# Altium schematic sheet PWR_MGMT.SchDoc
size B; SheetNumber: 7; SheetTotal: 7
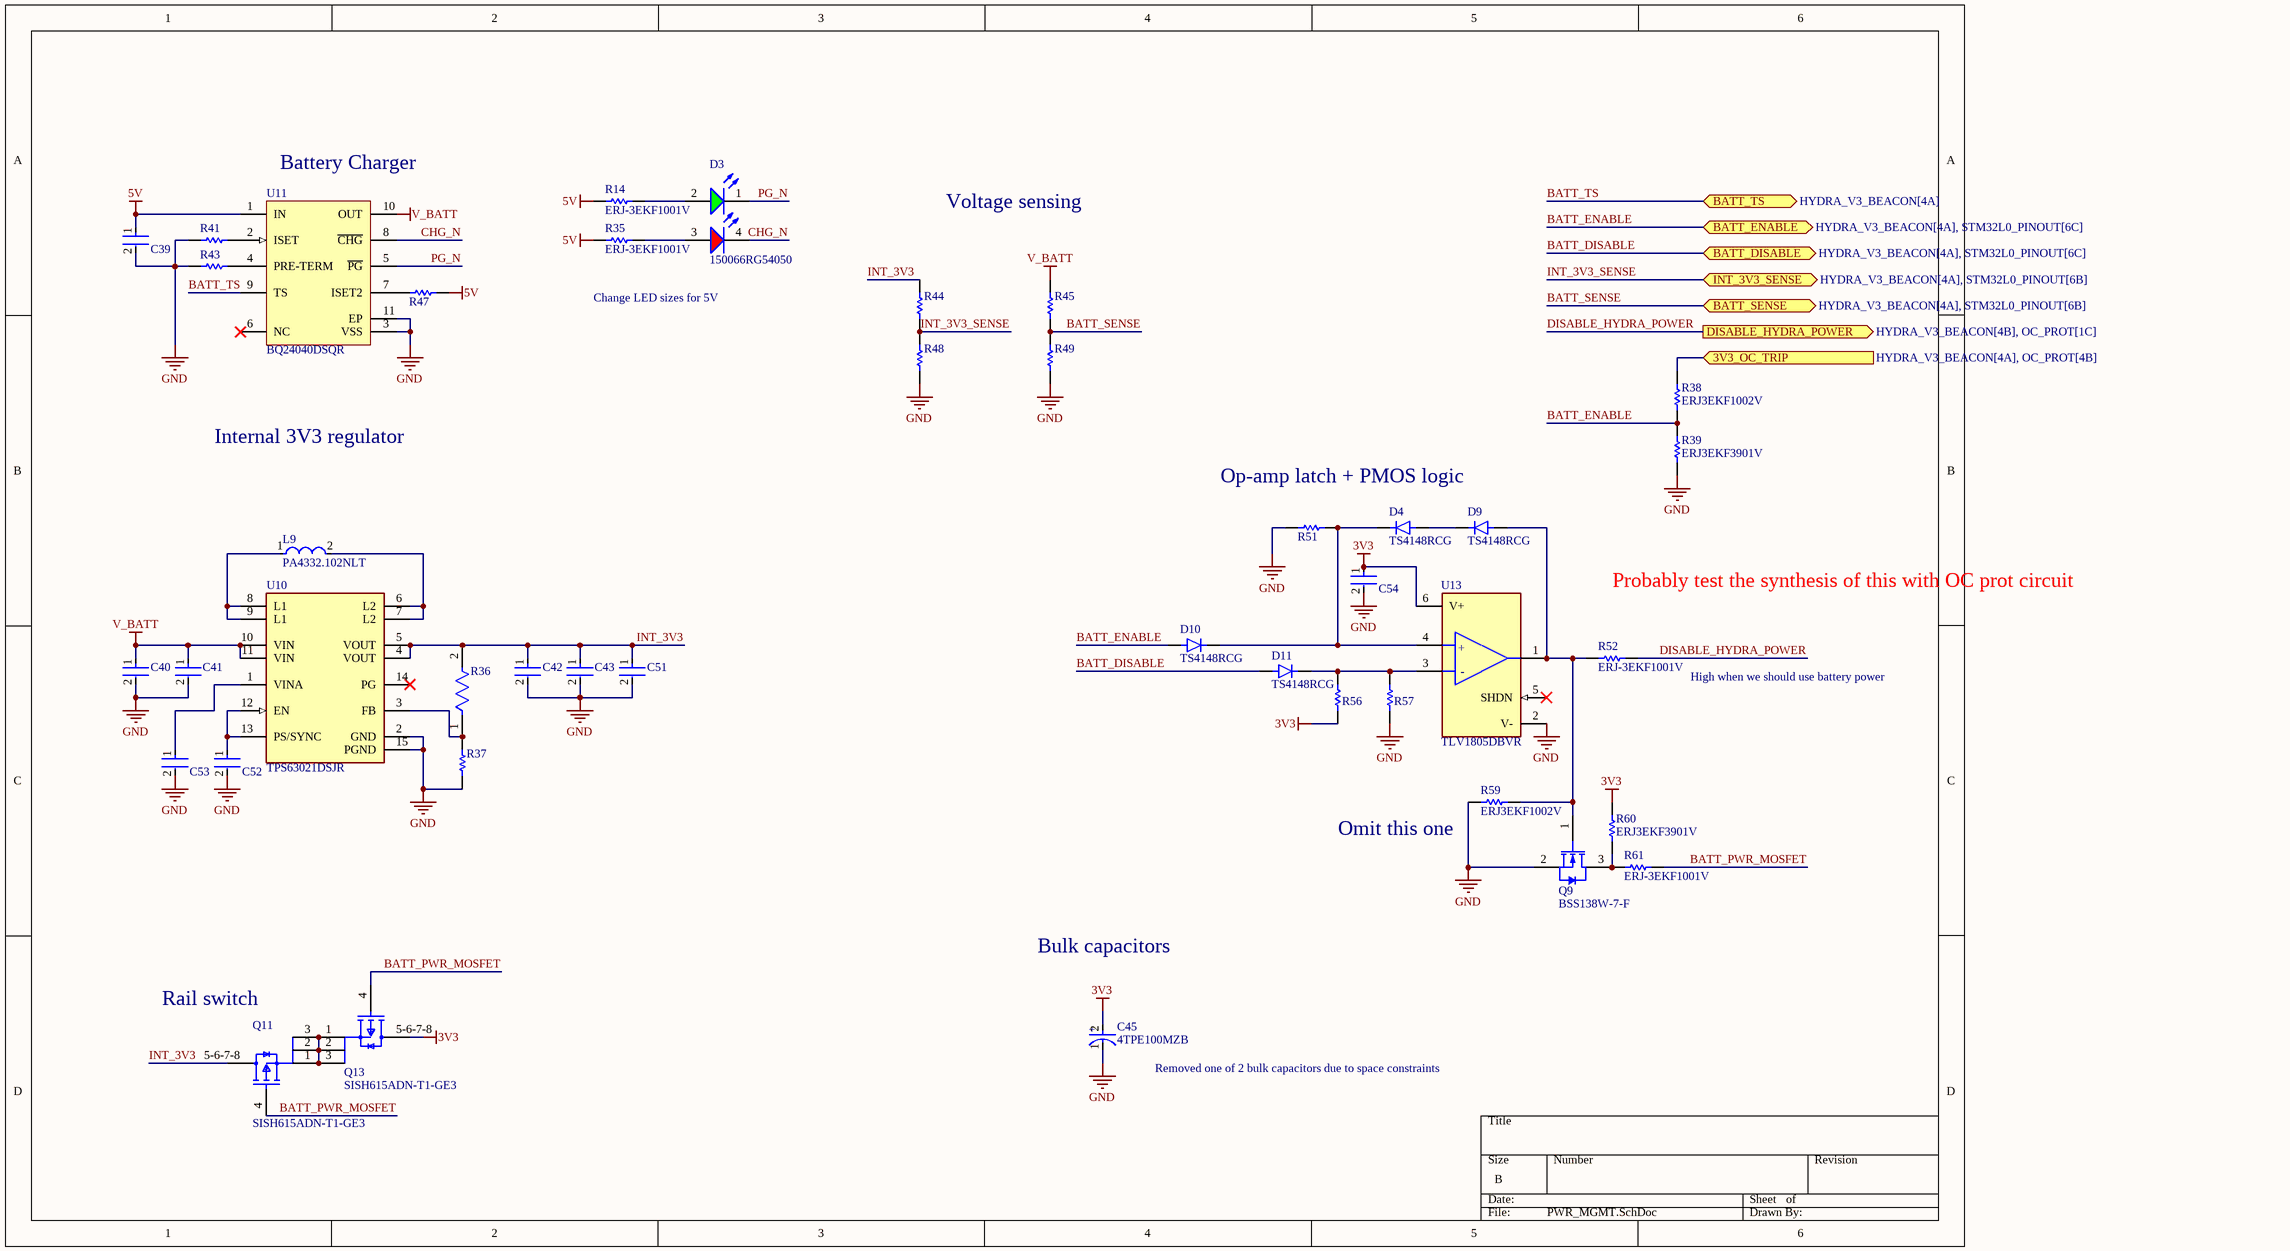
[diagram p0: PWR_MGMT.SchDoc]

## Parts
C39  C0402C104K8PACTU  [FP-C0402-BB-MFG]  (value not drawn)
C40  C0805C106K8PACTU  [FP-C0805C-DG-MFG]  (value not drawn)
C41  C0805C106K8PACTU  [FP-C0805C-DG-MFG]  (value not drawn)
C42  GRM21BR60J226ME39L  [FP-GRM21B-0_15-MFG]  (value not drawn)
C43  GRM21BR60J226ME39L  [FP-GRM21B-0_15-MFG]  (value not drawn)
C45  4TPE100MZB  [FP-POSCAP-B2-MFG]
C51  GRM21BR60J226ME39L  [FP-GRM21B-0_15-MFG]  (value not drawn)
C52  C0402C104K8PACTU  [FP-C0402-BB-MFG]  (value not drawn)
C53  C0402C104K8PACTU  [FP-C0402-BB-MFG]  (value not drawn)
C54  C0402C104K8PACTU  [FP-C0402-BB-MFG]  (value not drawn)
D3  150066RG54050  [WL-SBCD_0606]
D4  TS4148RCG  [TS4148RCG-Footprint-1]
D9  TS4148RCG  [TS4148RCG-Footprint-1]
D10  TS4148RCG  [TS4148RCG-Footprint-1]
D11  TS4148RCG  [TS4148RCG-Footprint-1]
L9  PA4332.102NLT  [FP-PA4332-MFG]
Q9  BSS138W-7-F  [DIOD-SOT323-3_V]
Q11  SISH615ADN-T1-GE3  [SISH615ADN-T1-GE3-Footprint-1]
Q13  SISH615ADN-T1-GE3  [SISH615ADN-T1-GE3-Footprint-1]
R14  ERJ-3EKF1001V  [RESC1608X55X30LL15T15]
R35  ERJ-3EKF1001V  [RESC1608X55X30LL15T15]
R36  ERJ-3EKF1004V  [FP-ERJ3EK-IPC_C]  (value not drawn)
R37  ERJ3EKF1803V  [RESC1608X55X30LL15T15]  (value not drawn)
R38  ERJ3EKF1002V  [RESC1609X55X30LL15T15]
R39  ERJ3EKF3901V  [RESC1608X55X30ML15T15]
R41  ERJ-3EKF1001V  [RESC1608X55X30LL15T15]  (value not drawn)
R43  ERJ-3EKF1001V  [RESC1608X55X30LL15T15]  (value not drawn)
R44  ERJ3EKF1002V  [RESC1609X55X30LL15T15]  (value not drawn)
R45  ERJ3EKF1002V  [RESC1609X55X30LL15T15]  (value not drawn)
R47  ERJ3EKF1002V  [RESC1609X55X30LL15T15]  (value not drawn)
R48  ERJ3EKF1002V  [RESC1609X55X30LL15T15]  (value not drawn)
R49  ERJ3EKF1002V  [RESC1609X55X30LL15T15]  (value not drawn)
R51  ERJ3EKF1002V  [RESC1609X55X30LL15T15]  (value not drawn)
R52  ERJ-3EKF1001V  [RESC1608X55X30LL15T15]
R56  ERJ3EKF1002V  [RESC1609X55X30LL15T15]  (value not drawn)
R57  ERJ3EKF1002V  [RESC1609X55X30LL15T15]  (value not drawn)
R59  ERJ3EKF1002V  [RESC1609X55X30LL15T15]
R60  ERJ3EKF3901V  [RESC1608X55X30ML15T15]
R61  ERJ-3EKF1001V  [RESC1608X55X30LL15T15]
U10  TPS63021DSJR  [FP-DSJ0014A-MFG]
U11  BQ24040DSQR  [DSQ0010A_V]
U13  TLV1805DBVR  [FP-DBV0006A-IPC_C]

## Ports
3V3_OC_TRIP (in, see HYDRA_V3_BEACON[4A], OC_PROT[4B]), BATT_DISABLE (bidir, see HYDRA_V3_BEACON[4A], STM32L0_PINOUT[6C]), BATT_ENABLE (bidir, see HYDRA_V3_BEACON[4A], STM32L0_PINOUT[6C]), BATT_SENSE (bidir, see HYDRA_V3_BEACON[4A], STM32L0_PINOUT[6B]), BATT_TS (bidir, see HYDRA_V3_BEACON[4A]), DISABLE_HYDRA_POWER (out, see HYDRA_V3_BEACON[4B], OC_PROT[1C]), INT_3V3_SENSE (bidir, see HYDRA_V3_BEACON[4A], STM32L0_PINOUT[6B])

## Nets
3V3: C45.2(A) C54.1 Q13.5-6-7-8(D) R56.1 R60.2 U13.6(V+)
5V: C39.1 R14.1 R35.1 R47.2 U11.1(IN)
GND: C39.2 C40.2 C41.2 C42.2 C43.2 C45.1(C) C51.2 C52.2 C53.2 C54.2 Q9.2(S) R37.1 R39.1 R41.2 R43.2 R48.1 R49.1 R51.2 R57.1 R59.2 U10.2(GND) U10.15(PGND) U11.3(VSS) U11.11(EP) U13.2(V-)
V_BATT: C40.1 C41.1 R45.2 U10.10(VIN) U10.11(VIN) U11.10(OUT)
3V3_OC_TRIP: R38.2 ; port 3V3_OC_TRIP
BATT_DISABLE: D11.A ; port BATT_DISABLE
BATT_ENABLE: D10.A R38.1 R39.2 ; port BATT_ENABLE
BATT_PWR_MOSFET: Q11.4(G) Q13.4(G) R61.2
BATT_SENSE: R45.1 R49.2 ; port BATT_SENSE
BATT_TS: U11.9(TS) ; port BATT_TS
CHG_N: D3.4(K) U11.8(~{CHG})
DISABLE_HYDRA_POWER: R52.1 ; port DISABLE_HYDRA_POWER
INT_3V3: C42.1 C43.1 C51.1 Q11.5-6-7-8(D) R36.2 R44.2 U10.4(VOUT) U10.5(VOUT)
INT_3V3_SENSE: R44.1 R48.2 ; port INT_3V3_SENSE
PG_N: D3.1(K) U11.5(~{PG})
NetC52_1: C52.1 U10.12(EN) U10.13(PS/SYNC)
NetC53_1: C53.1 U10.1(VINA)
NetD3_2: D3.2(A) R14.2
NetD3_3: D3.3(A) R35.2
NetD4_A: D4.A D9.C(K)
NetD4_C: D4.C(K) D10.C(K) R51.1 U13.4(+IN)
NetD9_A: D9.A Q9.1(G) R52.2 R59.1 U13.1(OUT)
NetD11_C: D11.C(K) R56.2 R57.2 U13.3(-IN)
NetL9_1: L9.1 U10.8(L1) U10.9(L1)
NetL9_2: L9.2 U10.6(L2) U10.7(L2)
NetQ9_3: Q9.3(D) R60.1 R61.1
NetQ11_1: Q11.1(S) Q11.2(S) Q11.3(S) Q13.1(S) Q13.2(S) Q13.3(S)
NetR36_1: R36.1 R37.2 U10.3(FB)
NetR41_1: R41.1 U11.2(ISET)
NetR43_1: R43.1 U11.4(PRE-TERM)
NetR47_1: R47.1 U11.7(ISET2)

Not connected (* = marked no-connect by the designer): U10 14(PG)*; U11 6(NC)*; U13 5(SHDN)*

## Notes on the sheet
- (near U11) Battery Charger
- Voltage sensing
- Change LED sizes for 5V
- Internal 3V3 regulator
- Op-amp latch + PMOS logic
- Probably test the synthesis of this with OC prot circuit
- High when we should use battery power
- (near R59) Omit this one
- (near Q11) Rail switch
- Bulk capacitors
- Removed one of 2 bulk capacitors due to space constraints
- (in symbol CMP-04896-000098-1) +; -
- (in symbol CMP-05428-001141-1) +

## Library data of the parts
C39 C52-C54 = CMP-2008-02046-2: CAP CER 0.1UF 10V X5R 0402; Manufacturer: Kemet; Material: Ceramic; Capacitance: 0.10 μF; Temperature Coefficient: 15%; Tolerance: 0.1; Value: 0.10 μF; Package: C0402-BB; Temperature: -55°C to +125°C; ComponentLink2Description: Datasheet; Temperature Characteristic: X5R; Device Class L1: Passive Components; Height: 0.55mm; Lead Free: Yes; ComponentLink2URL: https://content.kemet.com/datasheets/KEM_C1002_X7R_SMD.pdf; Device Class L2: Capacitors; Temperature Range Low: -55°C; Temperature Range High: +125°C; RoHS: TRUE; Octopart: https://octopart.com/c0402c104k8pactu-kemet-140039; Automotive: No; Mouser Description: Capacitor 100 nF 10 VDC 0402; Category: Cap; Voltage Rating: 10 V; Digikey Description: CAP CER 0.1UF 10V X5R 0402; Ipc Land Pattern Name: CAPC10050X50; Device Class L3: Ceramic Capacitors; Manufacturer Part Number: C0402C104K8PACTU
C40 C41 = CMP-2007-03243-2: CAP CER 10UF 10V X5R 0805; Manufacturer: Kemet; 3DS Part Number: 220-00001; Tolerance: 10%; Temperature Coefficient: 15%; Material: Ceramic; Device Class L2: Capacitors; Device Class L1: Passive Components; ComponentLink2URL: https://content.kemet.com/datasheets/KEM_C1006_X5R_SMD.pdf; Height: 1.4mm; Lead Free: Yes; Manufacturer Part Number: C0805C106K8PACTU; Digikey Description: CAP CER 10UF 10V X5R 0805; Octopart: https://octopart.com/c0805c106k8pactu-kemet-98697; Capacitance: 10uF; Value: 10uF; Temperature Range Low: -55°C; Temperature: -55°C to +85°C; Automotive: No; Mouser Description: CAP CER 10UF 10V X5R 0805; Ipc Land Pattern Name: CAPC200125X125; Temperature Range High: +85°C; Voltage: 10V; RoHS: TRUE; Device Class L3: Ceramic Capacitors; ComponentLink2Description: Datasheet; Voltage Rating: 10V; Package: C0805C-DG; Temperature Characteristic: X5R; Category: Cap
C42 C43 C51 = CMP-2007-03385-2: Chip Multilayer Ceramic Capacitors for General Purpose, 0805, 22uF, X5R, 15%, 20%, 6.3V; Material: Ceramic; Max Operating Temperature: 85°C; Voltage: 6.3V; Min Operating Temperature: -55°C; Case/Package: 0805; Thickness: 0.053inch; Dielectric: X5R; Packaging: Tape and Reel; Depth: 1.25mm; Termination: SMD/SMT; Voltage Rating (DC): 6.3V; Radiation Hardening: No; Tolerance: 20%; Mount: Surface Mount; Lead Free: Lead Free; Package Quantity: 1; REACH SVHC: No SVHC; Voltage Rating: 6.3V; Capacitance: 22uF; Length: 2mm; Case Code (Imperial): 0805; Case Code (Metric): 2012; Width: 0.049inch; Height: 1.25mm
C45 = CMP-05428-001141-1: Molded Tantalum Polymer Capacitor 100uF 20% 4V life 1000Hours SMD 1411; Leakage Current: 40uA; Polarity: Polar; Dissipation Factor: 8%; ESR (Equivalent Series Resistance): 35mR; Ripple Current: 1.4A; Capacitance: 100uF; Voltage: 4V; Voltage Rating (DC): 4V; Package Quantity: 2000; Packaging: Tape and Reel; RoHS Compliant: Yes; Voltage Rating: 4V; Case Code (Imperial): 1210; Construction: Flat; Max Operating Temperature: 105°C; Termination: SMD/SMT; Case Code (Metric): 3528; Case/Package: Molded; Tolerance: 20%; Min Operating Temperature: -55°C; Lead Free: Lead Free; Features: General Purpose; Height: 1.9mm; Length: 3.5mm; Series: POSCAP™ TPE; Number of Pins: 2; Height - Seated (Max): 0.079inch; Mount: Surface Mount; Width: 2.8mm; REACH SVHC: No SVHC; Radiation Hardening: No; Depth: 2.8mm
D3 = CMP-004-00034-2: Led, Red/Grn, 180Mcd/230Mcd, 624Nm/525Nm Rohs Compliant: Yes
D4 D9-D11 = CMP-004-00036-1: SMD Si-Diode 75V 100mA 0603
L9 = CMP-16293-000006-1: FIXED IND 1UH 5.8A 26 MOHM SMD; DC Resistance (DCR): 26mR; Self Resonant Frequency: 37MHz; Tolerance: 20%; Saturation Current: 8.5A; Core Material: Ferrite; Shielding: Shielded; Test Frequency: 1MHz; Min Operating Temperature: -40°C; Composition: Wirewound; Max Operating Temperature: 125°C; Packaging: Tape and Reel; Mount: Surface Mount; Length: 0.165inch; Current Rating: 5.8A; Inductance: 1uH; Case/Package: Nonstandard; Height - Seated (Max): 0.079inch; Width: 0.165inch
Q9 = CMP-2000-05968-1: N-Channel Enhancement Mode Mosfet, 50 V, 200 mA, -55 to 150 degC, 6-Pin SOT-323, RoHS, Tape and Reel; Typical Turn-Off Delay Time: 20ns; Number of Channels: 1Channel; Type: EnhancementModeFieldEffectTransistor; Brand: DiodesIncorporated; Vds - Drain-Source Breakdown Voltage: 75V; Vgs - Gate-Source Voltage: 20V; Rds On - Drain-Source Resistance: 1.4Ohms; Transistor Type: 1N-Channel; Configuration: Single; Unit Weight: 0.000212oz; Pd - Power Dissipation: 200mW; Id - Continuous Drain Current: 200mA; Forward Transconductance - Min: 0.1S; Manufacturer URL: http://www.diodes.com/; Series: BSS138; Package Description: 3-Pin Small Outline Transistor, Body 2 x 1.25 mm, Pitch 0.65 mm; Mounting Technology: SurfaceMount; Product Category: MOSFET; RoHS: True; Maximum Operating Temperature: +150C; Height: 1mm; Length: 2.2mm; Technology: Si; Width: 1.35mm; Datasheet URL: http://www.diodes.com/_files/datasheets/ds30206.pdf; Manufacturer: DiodesIncorporated; Package / Case: SOT-323-3; Typical Turn-On Delay Time: 20ns; Transistor Polarity: N-Channel; Factory Pack Quantity: 3000; Packaging: Reel; Product: MOSFETSmallSignal; Datasheet Version: Rev. 11-2, 09/2013; Package Reference: SOT323; Minimum Operating Temperature: -55C; Mounting Style: SMD/SMT; Channel Mode: Enhancement
Q11 Q13 = CMP-013-00036-1: Trans MOSFET P-CH 20V 22.1A 8-Pin PowerPAK 1212 EP T/R
R14 R35 R41 R43 R52 R61 = CMP-2000-00180-1: Manufacturer: Panasonic; Part Number: ERJ-3EKF1001V
R36 = CMP-1012-00849-3: RES SMD 1M OHM 1% 1/10W 0603; Resistance: 1MR; Voltage Rating: 75V; Temperature Coefficient: 100ppm/°C; Power Rating: 100mW; REACH SVHC: No SVHC; Radiation Hardening: No; Features: Automotive AEC-Q200; Case Code (Metric): 1608; Resistance Tolerance: 1%; Case/Package: 0603; Termination: SMD/SMT; Max Operating Temperature: 155°C; Tolerance: 1%; Size Code: 0603; Case Code (Imperial): 0603; Min Operating Temperature: -55°C; Number of Pins: 2; Mount: Surface Mount; Package Quantity: 1; Military Standard: Not; Voltage Rating (DC): 75V; Depth: 0.8mm; Packaging: Tape and Reel; Width: 0.8mm; Number of Terminations: 2; Length: 1.6mm; Height: 0.022inch; RoHS Compliant: Yes; Resistor Type: Thick Film; Contact Plating: Tin; Lead Free: Lead Free; Series: ERJ; Construction: Rectangular; Max Power Dissipation: 100mW
R37 = CMP-2000-00296-1: Manufacturer: Panasonic; Part Number: ERJ3EKF1803V
R38 R44 R45 R47-R49 R51 R56 R57 R59 = CMP-1012-00623-3: Chip Resistor, 10 KOhm, +/- 1%, 0.1 W, -55 to 155 degC, 0603 (1608 Metric), RoHS, Tape and Reel; Manufacturer: Panasonic; Voltage Rating: 75V; Case\/Package: 0603; Power Rating: 100mW; Resistance: 10KOhm; Temperature Coefficient: 100ppm\/degreesC; Number of Pins: 2; Package Reference: 603; Depth: 0.8mm; Mount: SurfaceMount; Package Description: 2-Pin Surface Mount Device, Body 1.6 x 0.85 mm; Datasheet Version: 02/2017; Length: 1.6mm; Lead Free: LeadFree; Height: 0.45mm; Number of Terminations: 2; Max Power Dissipation: 100mW; Min Operating Temperature: -55degC; Datasheet URL: https://industrial.panasonic.com/cdbs/www-data/pdf/RDA0000/AOA0000C304.pdf; Termination: SMD/SMT; Case Code (Metric): 1608; Case Code (Imperial): 0603; Tolerance: 1%; Max Operating Temperature: 155degC; RoHSCompliant: true; Voltage Rating (DC): 75V; Radiation Hardening: No; Packaging: TapeandReel; Composition: ThickFilm; Mounting Technology: SurfaceMount; Manufacturer URL: http://www.panasonic.com/; Width: 0.031inch; REACH SVHC: NoSVHC; Contact Plating: Tin; Military Standard: Not; Package Quantity: 1
R39 R60 = CMP-2000-00475-1: Manufacturer: Panasonic; Part Number: ERJ3EKF3901V
U10 = CMP-04918-000102-1: IC REG BCK BST 3.3V 3.5A 14VSON; Manufacturer: Texas Instruments; Max Junction Temp: +125°C; Output Current: 2A; Switching Topology: Buck-Boost; Min Supply Voltage: 1.8V; Standoff Height: 0mm; Switching Frequency: 2400kHz; Output Type: AdjustableProgrammable; Max Supply Voltage: 5.5V; Output Voltage: 1.2-5.5V; Max Duty Cycle: 100%; Number Of Outputs: 1; Nominal Supply Current: 25uA; Mouser Description: Conv DC-DC 1.8V to 5.5V Non-Inv/Inv/Step Up/Step Down Single-Out 3.3V 3A 14-Pin VSON EP T/R; Octopart: https://octopart.com/tps63021dsjr-texas+instruments-17659431; Temperature: -40°C to +85°C; RoHS: TRUE; Package: DSJ0014A; Device Class L3: Voltage Regulators - Switching; Height: 1mm; Ambient Temperature Range Low: -40°C; Device Class L2: Power Management ICs; Temperature Range High: +85°C; ComponentLink2URL: http://www.ti.com/lit/ds/symlink/tps63021.pdf; Device Class L1: Integrated Circuits (ICs); ComponentLink2Description: Datasheet; Automotive: No; Manufacturer Part Number: TPS63021DSJR; Lead Free: Yes; Digikey Description: IC REG BCK BST 3.3V 3.5A 14VSON; Temperature Range Low: -40°C; Category: IC; Ambient Temperature Range High: +85°C
U11 = CMP-0321-00456-2: 800 mA, Single-Input, Single Cell Li-Ion Battery Charger with Auto Start. Vovp=6.6 V, 3.5 V, -40 to 85 degC, 10-pin SON (DSQ), Green (RoHS & no Sb/Br); Manufacturer: Texas Instruments; NiCd: N; Vin(Min)(V): 3.5; SubFamily: Battery Charge Management; PackageDescription: 10-Pin Plastic Small Outline No-Lead, 2 x 2 x 0.8 mm Body, 0.4 mm Pitch, Exposed Pad; PackageVersion: revB, Apr-2010; Mounting Technology: Surface Mount; Eco-Plan: Green (RoHS & no Sb/Br); ComponentLink1URL: http://www.ti.com/general/docs/lit/getliterature.tsp?genericPartNumber=BQ24040&fileType=pdf; PartNumber: BQ24040DSQR; DatasheetVersion: SLUS941A; Over Voltage Protection: N; PackageReference: DSQ0010A; NiMH: N; Li-Ion: N; Lead Acid: N; Li-Polymer: N; ComponentLink1Description: Datasheet
U13 = CMP-04896-000098-1: 40V, RAIL-TO-RAIL INPUT, PUSH-PU